# Altium schematic sheet Sheet_ESP8266开发板.schdoc
size 288 x 202 mm
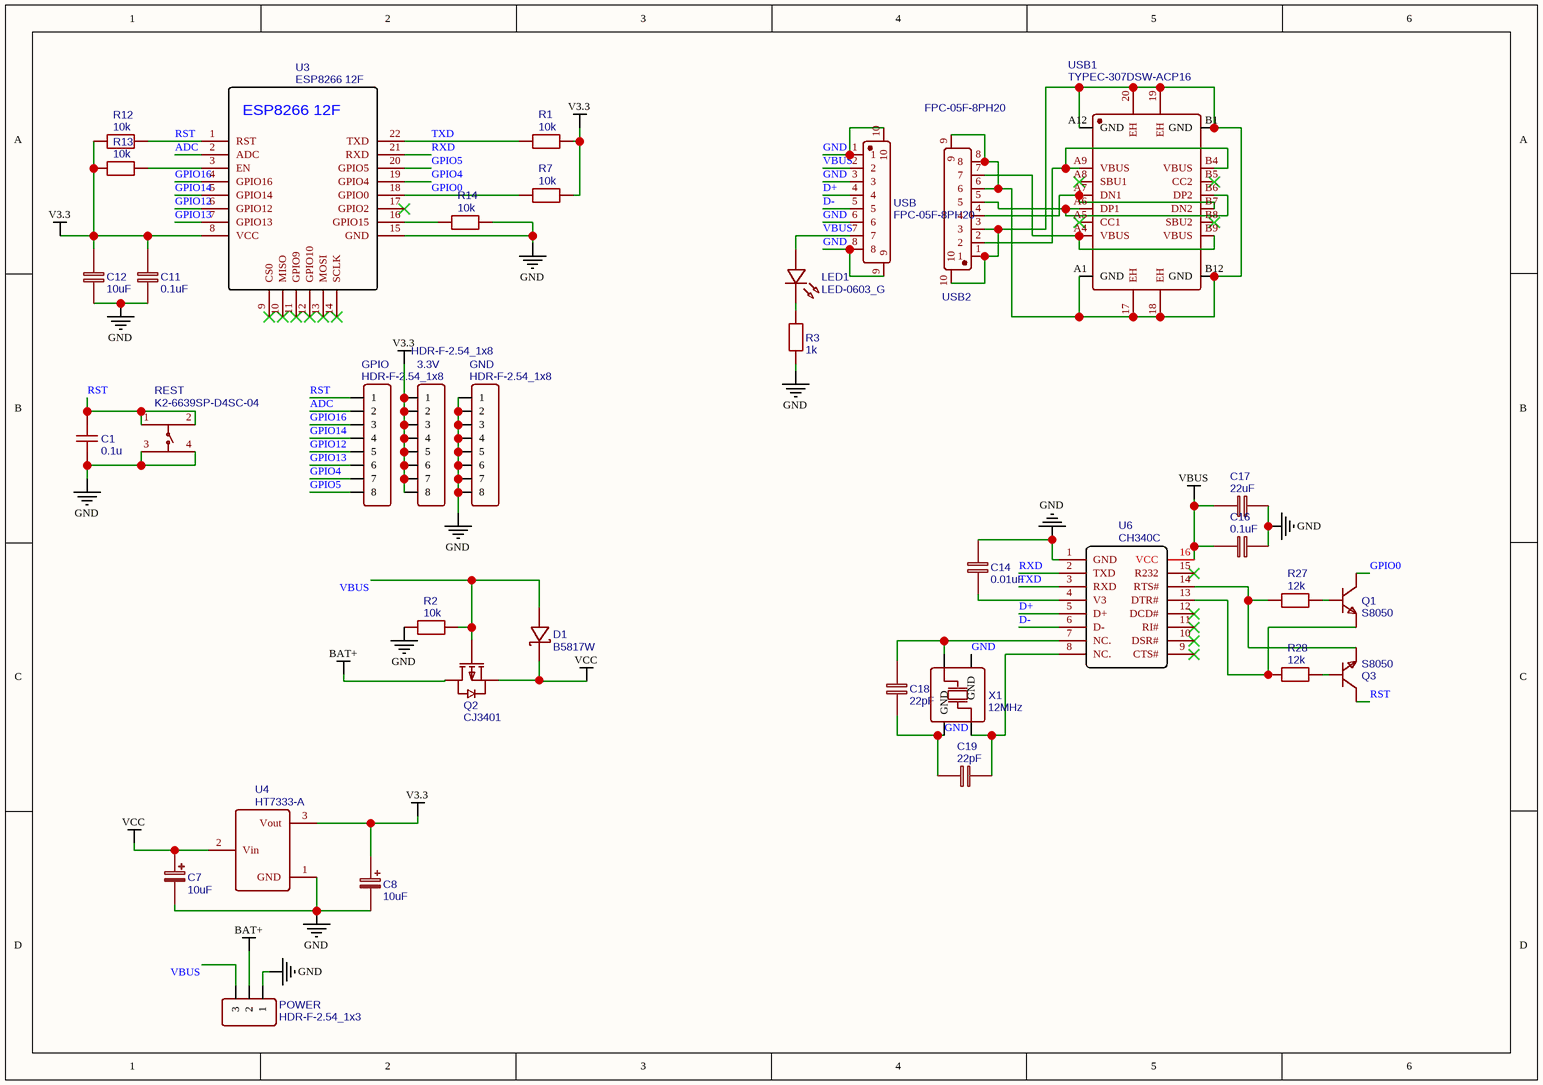
[diagram p0: Sheet_ESP8266开发板.schdoc]

## Parts
3.3V  HDR-F-2.54_1x8  [HDR-F-2.54_1X8]
C1  0.1u  [C0603]
C7  10uF  [CASE-A_3216]
C8  10uF  [CASE-A_3216]
C11  0.1uF  [C0603]
C12  10uF  [C0603]
C14  0.01uF  [C0603]
C16  0.1uF  [C0603]
C17  22uF  [C0603]
C18  22pF  [C0603]
C19  22pF  [C0603]
D1  B5817W  [SOD-123_L2.8-W1.8-LS3.7-RD]
GND  HDR-F-2.54_1x8  [HDR-F-2.54_1X8]
GPIO  HDR-F-2.54_1x8  [HDR-F-2.54_1X8]
LED1  LED-0603_G  [LED0603_GREEN]
POWER  HDR-F-2.54_1x3  [HDR-F-2.54_1X3]
Q1  S8050  [SOT-23-3_L2.9-W1.3-P1.90-LS2.4-BR]
Q2  CJ3401  [SOT23-3]
Q3  S8050  [SOT-23-3_L2.9-W1.3-P1.90-LS2.4-BR]
R1  10k  [R0603]
R2  10k  [R0603]
R3  1k  [R0603]
R7  10k  [R0603]
R12  10k  [R0603]
R13  10k  [R0603]
R14  10k  [R0603]
R27  12k  [R0603]
R28  12k  [R0603]
REST  K2-6639SP-D4SC-04  [KEY-SMD_4P-L6.0-W6.0-P3.90-LS10.0]
U3  ESP8266 12F  [ESP8266 12F]
U4  HT7333-A  [SOT-89-3_L4.5-W2.5-P1.50-LS4.2-BR]
U6  CH340C  [SOP-16_L10.0-W3.9-P1.27-LS6.0-BL]
USB  FPC-05F-8PH20  [FPC-SMD_8P-P0.50_FPC-05F-8PH20]
USB1  TYPEC-307DSW-ACP16  [USB-C-SMD_TYPEC-307DSW-ACP16]
USB2  FPC-05F-8PH20  [FPC-SMD_8P-P0.50_FPC-05F-8PH20]
X1  12MHz  [OSC-SMD_4P-L3.2-W2.5-BL]

## Nets
BAT+: POWER.2 Q2.3(D)
GND: C1.1 C7.2 C8.2 C11.1 C12.1 C14.2 C16.1 C17.1 C18.1 C19.2 GND.1 GND.2 GND.3 GND.4 GND.5 GND.6 GND.7 GND.8 POWER.1 R2.1 R3.1 R14.1 REST.3 REST.4 U3.15(GND) U4.1(GND) U6.1(GND) USB.1 USB.3 USB.6 USB.8 USB.9 USB.10 X1.2(GND) X1.4(GND)
V3.3: 3.3V.1 3.3V.2 3.3V.3 3.3V.4 3.3V.5 3.3V.6 3.3V.7 3.3V.8 C8.1 C11.2 C12.2 R1.1 R7.1 R12.2 R13.2 U3.8(VCC) U4.3(Vout)
VBUS: C16.2 C17.2 D1.2(A) LED1.1 POWER.3 Q2.1(G) R2.2 U6.16(VCC) USB.2 USB.7
VCC: C7.1 D1.1(K) Q2.2(S) U4.2(Vin)
ADC: GPIO.2 U3.2(ADC)
D+: U6.5(D+) USB.4
D-: U6.6(D-) USB.5
GPIO0: Q1.3(C) R7.2 U3.18(GPIO0)
GPIO4: GPIO.7 U3.19(GPIO4)
GPIO5: GPIO.8 U3.20(GPIO5)
GPIO12: GPIO.5 U3.6(GPIO12)
GPIO13: GPIO.6 U3.7(GPIO13)
GPIO14: GPIO.4 U3.5(GPIO14)
GPIO16: GPIO.3 U3.4(GPIO16)
RST: C1.2 GPIO.1 Q3.3(C) R12.1 REST.1 REST.2 U3.1(RST)
RXD: U3.21(RXD) U6.2(TXD)
TXD: R1.2 U3.22(TXD) U6.3(RXD)
NetC14_1: C14.1 U6.4(V3)
NetC18_2: C18.2 U6.7(NC.) X1.1(OSC1)
NetC19_1: C19.1 U6.8(NC.) X1.3(OSC2)
NetLED1_2: LED1.2 R3.2
NetQ1_1: Q1.1(B) R27.2
NetQ1_2: Q1.2(E) R28.1 U6.13(DTR#)
NetQ3_1: Q3.1(B) R28.2
NetQ3_2: Q3.2(E) R27.1 U6.14(RTS#)
NetR13_1: R13.1 U3.3(EN)
NetR14_2: R14.2 U3.16(GPIO15)
NetUSB1_17: USB1.17(EH) USB1.18(EH) USB1.19(EH) USB1.20(EH) USB1.A1(GND) USB1.A12(GND) USB1.B1(GND) USB1.B12(GND) USB2.1 USB2.3 USB2.6 USB2.8 USB2.9 USB2.10
NetUSB1_A4: USB1.A4(VBUS) USB1.B9(VBUS) USB2.7
NetUSB1_A6: USB1.A6(DP1) USB1.B6(DP2) USB2.5
NetUSB1_A7: USB1.A7(DN1) USB1.B7(DN2) USB2.4
NetUSB1_A9: USB1.A9(VBUS) USB1.B4(VBUS) USB2.2

Not connected (* = marked no-connect by the designer): U3 9(CS0)* 10(MISO)* 11(GPIO9)* 12(GPIO10)* 13(MOSI)* 14(SCLK)* 17(GPIO2)*; U6 9(CTS#)* 10(DSR#)* 11(RI#)* 12(DCD#)* 15(R232)*; USB1 A5(CC1)* A8(SBU1)* B5(CC2)* B8(SBU2)*

## Library data of the parts
3.3V GND GPIO = HDR-F-2.54_1x8: Contributor: LCEDA_Lib; BOM_Supplier Part: C225505; BOM_Supplier: LCSC; spicePre: H; spiceSymbolName: HDR-F-2.54_1x8
C1 = 0.1u: nameAlias: Value(F); Contributor: LCEDA_Lib; spicePre: C; spiceSymbolName: C_0603_US
C7 C8 C12 = 10uF: nameAlias: Value(F); Contributor: LCEDA_Lib; spicePre: C
  C7 C8: spiceSymbolName: C_Tan_SMD_A_EU
  C12: spiceSymbolName: C_0603_EU
C11 C16 = 0.1uF: nameAlias: Value(F); Contributor: LCEDA_Lib; spicePre: C; spiceSymbolName: C_0603_EU
C14 = 0.01uF: nameAlias: Value(F); Contributor: LCEDA_Lib; spicePre: C; spiceSymbolName: C_0603_EU
C17 = 22uF: nameAlias: Value(F); Contributor: LCEDA_Lib; spicePre: C; spiceSymbolName: C_0603_EU
C18 C19 = 22pF: nameAlias: Value(F); Contributor: LCEDA_Lib; spicePre: C; spiceSymbolName: C_0603_EU
D1 = B5817W: BOM_Manufacturer: HT; Contributor: LCSC; BOM_Supplier: LCSC; BOM_Manufacturer Part: B5817W; BOM_Supplier Part: C179719; BOM_JLCPCB Part Class: Extended Part; spicePre: D; spiceSymbolName: B5817W
LED1 = LED-0603_G: BOM_Manufacturer: EVERLIGHT(台湾亿光); BOM_Manufacturer Part: 19-217/GHC-YR1S2/3T; Contributor: LCEDA_Lib; BOM_Supplier Part: C72043; BOM_Supplier: LCSC; spicePre: L; spiceSymbolName: LED-0603_G
POWER = HDR-F-2.54_1x3: Contributor: LCEDA_Lib; BOM_Supplier Part: C146690; BOM_Supplier: LCSC; spicePre: H; spiceSymbolName: HDR-F-2.54_1x3
Q1 Q3 = S8050: BOM_Manufacturer: JSMSEMI; Contributor: LCSC; BOM_Supplier: LCSC; BOM_Supplier Part: C916390; BOM_Manufacturer Part: S8050; BOM_JLCPCB Part Class: Extended Part; spicePre: Q; spiceSymbolName: S8050
Q2 = CJ3401: BOM_Manufacturer: CJ; SMT Type: Extend; Contributor: lwjyl; BOM_Supplier: LCSC; BOM_Manufacturer Part: CJ3401; image: //image.lceda.cn/szlcsc/C13799.jpg; BOM_Supplier Part: C13799; BOM_LCSC Assembly: Yes; spicePre: Q; spiceSymbolName: CJ3401
R1 R2 R7 R12-R14 = 10k: nameAlias: Value(Ω); Contributor: LCEDA_Lib; spicePre: R; spiceSymbolName: R_0603_EU
R3 = 1k: nameAlias: Value(Ω); Contributor: LCEDA_Lib; spicePre: R; spiceSymbolName: R_0603_EU
R27 R28 = 12k: nameAlias: Value(Ω); Contributor: LCEDA_Lib; spicePre: R; spiceSymbolName: R_0603_EU
REST = K2-6639SP-D4SC-04: BOM_Manufacturer: Rectangular Connectors - Contacts; Contributor: LCSC; BOM_Supplier: LCSC; BOM_Supplier Part: C191626; BOM_Manufacturer Part: K2-6639SP-D4SC-04; BOM_JLCPCB Part Class: Extended Part; spicePre: S; spiceSymbolName: K2-6639SP-D4SC-04
U3 = ESP8266 12F: Contributor: gerdmuller.de; sourceId: wXx7531YW; timeStamp: 1472988624; spicePre: U; spiceSymbolName: ESP8266 12F
U4 = HT7333-A: BOM_Manufacturer: HOLTEK; BOM_Supplier: LCSC; BOM_Manufacturer Part: HT7333-A; BOM_Supplier Part: C21583; BOM_JLCPCB Part Class: Extended Part; spicePre: U; spiceSymbolName: HT7333-A
U6 = CH340C: BOM_Manufacturer: WCH; BOM_Supplier: LCSC; BOM_Manufacturer Part: CH340C; BOM_Supplier Part: C84681; BOM_JLCPCB Part Class: Extended Part; spicePre: U; spiceSymbolName: CH340C
USB USB2 = FPC-05F-8PH20: BOM_Manufacturer: XUNPU(讯普); Contributor: LCSC; BOM_Supplier: LCSC; BOM_Supplier Part: C2856797; BOM_Manufacturer Part: FPC-05F-8PH20; BOM_JLCPCB Part Class: Extended Part; spicePre: F; spiceSymbolName: FPC-05F-8PH20
USB1 = TYPEC-307DSW-ACP16: BOM_Manufacturer: XUNPU(讯普); Contributor: LCSC; BOM_Supplier: LCSC; BOM_Supplier Part: C2840402; BOM_Manufacturer Part: TYPEC-307DSW-ACP16; spicePre: U; spiceSymbolName: TYPEC-307DSW-ACP16
X1 = 12MHz: BOM_Manufacturer: TXC; BOM_Manufacturer Part: 7M1209LCSC-DDJ4S; nameAlias: Frequency; Contributor: LCSC; BOM_Supplier: LCSC; BOM_Supplier Part: C90900; BOM_JLCPCB Part Class: Extended Part; spicePre: X; spiceSymbolName: 7M1209LCSC-DDJ4S